# Altium project Isolator.PrjPCB
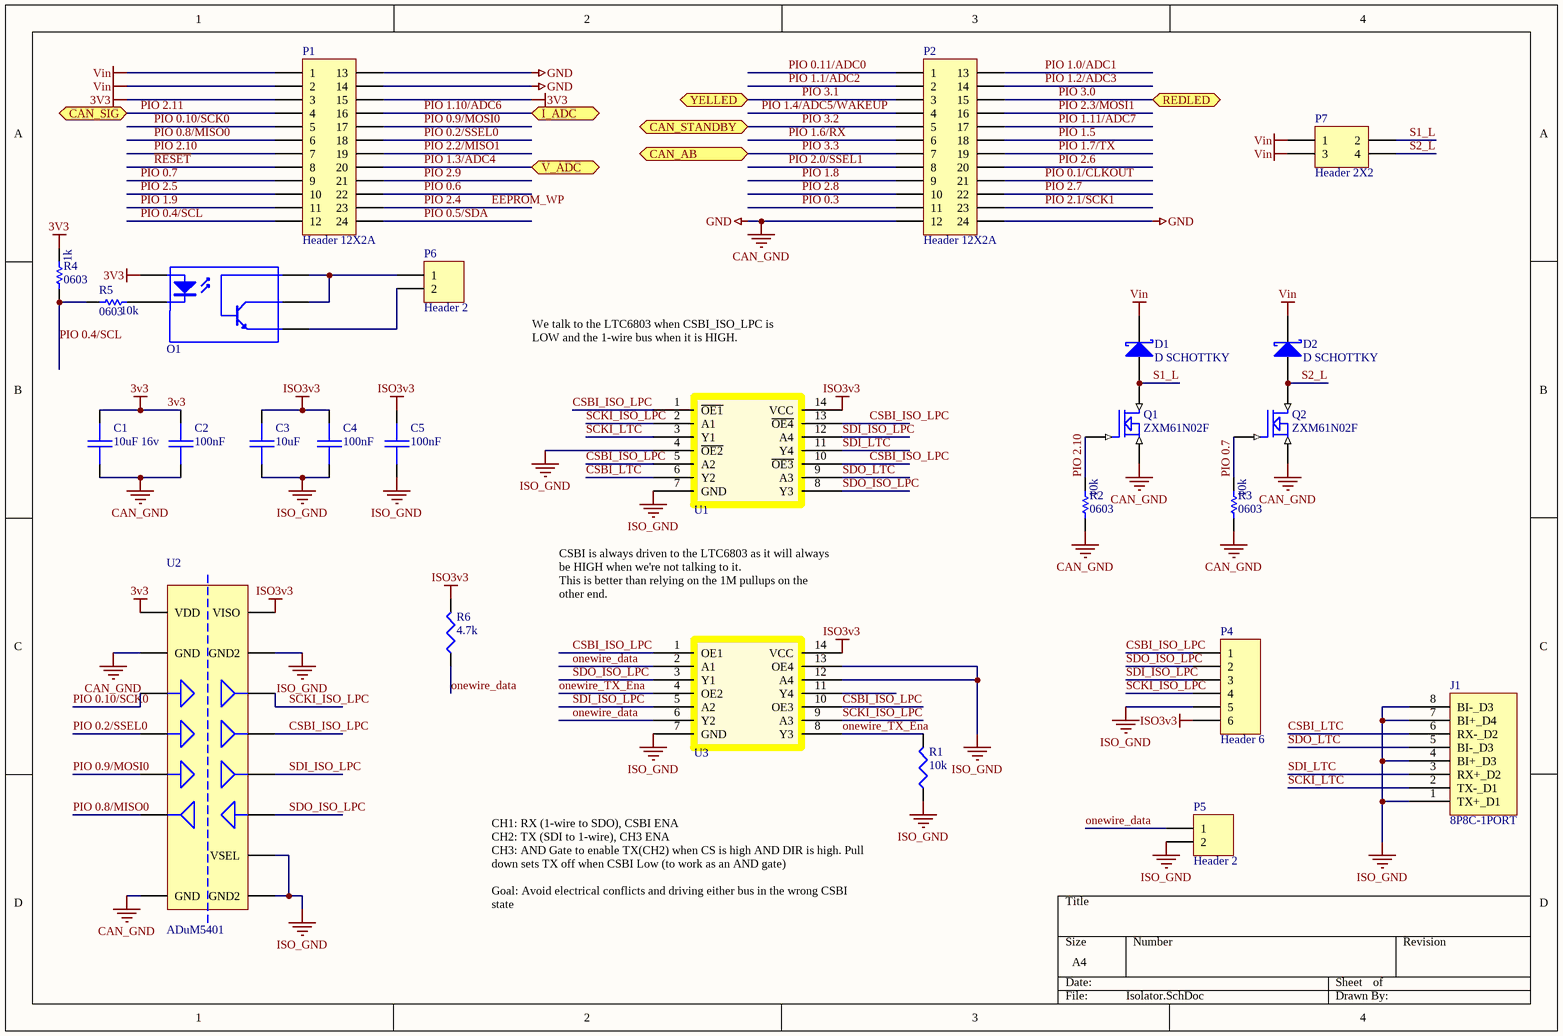
[diagram p0: Isolator.SchDoc]
1 sheet, 26 parts. Net scope: flat (ports and power ports of the same name join across sheets).
Board file: isolator.PcbDoc

## Sheet Isolator.SchDoc
size A4

### Parts
C1  10uF 16v  [1206]
C2  100nF  [0603]
C3  10uF  [1206]
C4  100nF  [0603]
C5  100nF  [0603]
D1  D SCHOTTKY  [SMB]
D2  D SCHOTTKY  [SMB]
J1  8P8C-1PORT  [8P8C-1PORT]
O1  VOM452T  [VOM452T]  (value not drawn)
P1  Header 12X2A  [HDR2X12_CEN]
P2  Header 12X2A  [HDR2X12_CEN]
P4  Header 6  [HDR1X6]
P5  Header 2  [HDR1X2]
P6  Header 2  [HDR1X2]
P7  Header 2X2  [HDR2X2]
Q1  ZXM61N02F  [SOT23-3]
Q2  ZXM61N02F  [SOT23-3]
R1  10k  [0603]
R2  value 10k  package: 0603  [0603_M]  (hidden comment: R)
R3  value 10k  package: 0603  [0603_M]  (hidden comment: R)
R4  value 1k  package: 0603  [0603_M]  (hidden comment: R)
R5  value 10k  package: 0603  [0603_M]  (hidden comment: R)
R6  4.7k  [0603]
U1  74HC125  [SO14]  (value not drawn)
U2  ADuM5401  [SOIC_W16]
U3  74HC126  [SO14]  (value not drawn)

### Ports
CAN_AB, CAN_SIG, CAN_STANDBY, I_ADC, REDLED (bidir), V_ADC, YELLED (bidir)

### Nets
3v3: C1.1 C2.1 O1.1(A) P1.3 P1.15 R4.2 U2.1(VDD)
CAN_GND: C1.2 C2.2 P1.13 P1.14 P2.12 P2.24 Q1.2(S) Q2.2(S) R2.1 R3.1 U2.2(GND) U2.8(GND)  [also labelled GND]
ISO3v3: C3.1 C4.1 C5.1 P4.6 R6.2 U1.14(VCC) U2.16(VISO) U3.14(VCC)
ISO_GND: C3.2 C4.2 C5.2 J1.1(TX+_D1) J1.4(BI+_D3) J1.7(BI+_D4) J1.8(BI-_D3) P4.5 P5.2 R1.1 U1.4(~{OE2}) U1.7(GND) U2.9(GND2) U2.10(VSEL) U2.15(GND2) U3.7(GND) U3.12(A4) U3.13(OE4)
Vin: D1.K D2.K P1.1 P1.2 P7.1 P7.3
CSBI_ISO_LPC: P4.1 U1.1(~{OE1}) U1.5(A2) U1.10(~{OE3}) U1.13(~{OE4}) U2.13(OUT2) U3.1(OE1) U3.10(OE3)
CSBI_LTC: J1.6(RX-_D2) U1.6(Y2)
EEPROM_WP: P1.23  [also labelled PIO 2.4]
onewire_data: P5.1 R6.1 U3.2(A1) U3.6(Y2)
onewire_TX_Ena: R1.2 U3.4(OE2) U3.8(Y3)
PIO 0.1/CLKOUT: P2.21
PIO 0.2/SSEL0: P1.18 U2.4(IN2)
PIO 0.3: P2.11
PIO 0.4/SCL: P1.12 R4.1 R5.1
PIO 0.5/SDA: P1.24
PIO 0.6: P1.22
PIO 0.7: P1.9 Q2.1(G) R3.2
PIO 0.8/MISO0: P1.6 U2.6(OUT4)
PIO 0.9/MOSI0: P1.17 U2.5(IN3)
PIO 0.10/SCK0: P1.5 U2.3(IN1)
PIO 0.11/ADC0: P2.1
PIO 1.0/ADC1: P2.13
PIO 1.1/ADC2: P2.2
PIO 1.2/ADC3: P2.14
PIO 1.3/ADC4: P1.20 ; port V_ADC
PIO 1.4/ADC5/WAKEUP: P2.4
PIO 1.5: P2.18
PIO 1.6/RX: P2.6
PIO 1.7/TX: P2.19
PIO 1.8: P2.9
PIO 1.9: P1.11
PIO 1.10/ADC6: P1.16 ; port I_ADC
PIO 1.11/ADC7: P2.17
PIO 2.0/SSEL1: P2.8
PIO 2.1/SCK1: P2.23
PIO 2.2/MISO1: P1.19
PIO 2.3/MOSI1: P2.16
PIO 2.5: P1.10
PIO 2.6: P2.20
PIO 2.7: P2.22
PIO 2.8: P2.10
PIO 2.9: P1.21
PIO 2.10: P1.7 Q1.1(G) R2.2
PIO 2.11: P1.4 ; port CAN_SIG
PIO 3.0: P2.15 ; port REDLED
PIO 3.1: P2.3 ; port YELLED
PIO 3.2: P2.5 ; port CAN_STANDBY
PIO 3.3: P2.7 ; port CAN_AB
~{RESET}: P1.8
S1_L: D1.A P7.2 Q1.3(D)
S2_L: D2.A P7.4 Q2.3(D)
SCKI_ISO_LPC: P4.4 U1.2(A1) U2.14(OUT1) U3.9(A3)
SCKI_LTC: J1.2(TX-_D1) U1.3(Y1)
SDI_ISO_LPC: P4.3 U1.12(A4) U2.12(OUT3) U3.5(A2)
SDI_LTC: J1.3(RX+_D2) U1.11(Y4)
SDO_ISO_LPC: P4.2 U1.8(Y3) U2.11(IN4) U3.3(Y1)
SDO_LTC: J1.5(BI-_D3) U1.9(A3)
NetO1_3: O1.3(K) R5.2
NetO1_4: O1.4(E) P6.2
NetO1_5: O1.5(C) O1.6(C) P6.1

Not connected (* = marked no-connect by the designer): U3 11(Y4)

### Notes on the sheet
- (near U1) We talk to the LTC6803 when CSBI_ISO_LPC is LOW and the 1-wire bus when it is HIGH.
- CSBI is always driven to the LTC6803 as it will always be HIGH when we're not talking to it.
  This is better than relying on the 1M pullups on the other end.
- CH1: RX (1-wire to SDO), CSBI ENA
  CH2: TX (SDI to 1-wire), CH3 ENA
  CH3: AND Gate to enable TX(CH2) when CS is high AND DIR is high. Pull down sets TX off when CSBI Low (to work as an AND gate)
  Goal: Avoid electrical conflicts and driving either bus in the wrong CSBI state

### Library data of the parts
C1-C5 = CAP: Capacitor
D1 D2 = D SCHOTTKY: Schottky Diode; Manufacturer: Generic Components; Class I: Discrete; Class II: Diode - Schottky; Published: 8-Jun-2000; Revision: July-2002: Re-released for DXP Platform.; Publisher: Altium Limited
P1 P2 = Header 12X2A: Header, 12-Pin, Dual row; LatestRevisionDate: 17-Jul-2002; LatestRevisionNote: Re-released for DXP Platform.; Publisher: Altium Limited
P4 = Header 6: Header, 6-Pin; LatestRevisionDate: 17-Jul-2002; LatestRevisionNote: Re-released for DXP Platform.; Publisher: Altium Limited
P5 P6 = Header 2: Header, 2-Pin; LatestRevisionDate: 17-Jul-2002; LatestRevisionNote: Re-released for DXP Platform.; Publisher: Altium Limited
P7 = Header 2X2: Header, 2-Pin, Dual row; LatestRevisionDate: 17-Jul-2002; LatestRevisionNote: Re-released for DXP Platform.; Publisher: Altium Limited
Q1 Q2 = ZXM61N02F: 1.7A, 20V N-Channel Enhancement mode FET
R1 R6 = RES1: Resistor
R2-R5 = R: Resistor; Supplier 1: Digikey
U1 = SN74HC125: buffer tri-state non-inv low-oe; Manufacturer: Texas Instruments; Manufacturer Part Number: SN74HC125D; Logic Type: Buffer/Line Driver, Non-Inverting; Number of Elements: 4; Number of Bits per Element: 1; Current - Output High, Low: 7.8mA, 7.8mA; Voltage - Supply: 2 V ~ 6 V; Supplier 1: Digi-Key; RoHS: RoHS Compliant; Category: Integrated Circuits (ICs); Stock 1: 302; Pricing 1: 1=0.69, 10=0.543, 25=0.458, 100=0.3726, 250=0.30876, 500=0.25554, 1000=0.19165, 2500=0.17568, 5000=0.16503 (AUD); Packaging: Tube; Operating Temperature: -40°C ~ 85°C; Mounting Type: Surface Mount; Package / Case: 14-SOIC (0.154", 3.90mm Width); Supplier Device Package: 14-SOIC; ComponentLink1URL: http://www.ti.com/lit/ds/symlink/sn74hc125.pdf; ComponentLink1Description: http://www.ti.com/lit/ds/symlink/sn74hc125.pdf; Supplier Part Number 1: 296-1192-5-ND
U2 = ADuM5401: Isolator w/ DCDC; Digikey: ADUM5401ARWZ-ND
U3 = SN74HC126: buffer tri-state non-inv high-oe; Manufacturer: Texas Instruments; Manufacturer Part Number: SN74HC126D; Logic Type: Buffer/Line Driver, Non-Inverting; Number of Elements: 4; Number of Bits per Element: 1; Current - Output High, Low: 7.8mA, 7.8mA; Voltage - Supply: 2 V ~ 6 V; Supplier 1: Digi-Key; RoHS: RoHS Compliant; Category: Integrated Circuits (ICs); Stock 1: 3632; Pricing 1: 1=0.69, 10=0.543, 25=0.458, 100=0.3726, 250=0.30876, 500=0.25554, 1000=0.19165, 2500=0.17568, 5000=0.16503 (AUD); Packaging: Tube; Operating Temperature: -40°C ~ 85°C; Mounting Type: Surface Mount; Package / Case: 14-SOIC (0.154", 3.90mm Width); Supplier Device Package: 14-SOIC; ComponentLink1URL: http://www.ti.com/lit/ds/symlink/sn74hc126.pdf; ComponentLink1Description: http://www.ti.com/lit/ds/symlink/sn74hc126.pdf; Supplier Part Number 1: 296-8219-5-ND